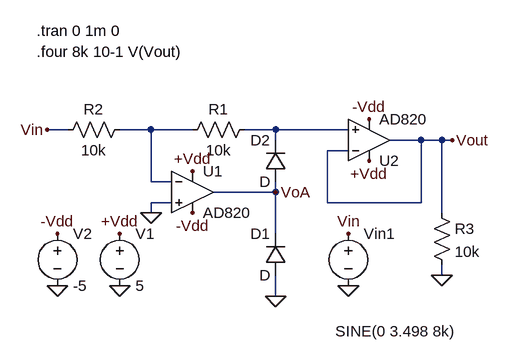
[diagram p0: schematic Etaj4 (2).asc]
Etaj4 (2).asc, the LTspice schematic file:
Version 4.1
SHEET 1 880 680
WIRE -64 -16 -96 -16
WIRE 64 -16 16 -16
WIRE 128 -16 64 -16
WIRE 256 -16 208 -16
WIRE 368 -16 256 -16
WIRE 256 0 256 -16
WIRE 480 0 432 0
WIRE 512 0 480 0
WIRE 528 0 512 0
WIRE 368 16 336 16
WIRE 64 64 64 -16
WIRE 96 64 64 64
WIRE 256 80 256 64
WIRE 256 80 160 80
WIRE 96 96 64 96
WIRE 336 96 336 16
WIRE 480 96 480 0
WIRE 480 96 336 96
WIRE 64 112 64 96
WIRE 512 112 512 0
WIRE 256 144 256 80
WIRE 512 208 512 192
WIRE 256 240 256 208
FLAG 512 208 0
FLAG 528 0 Vout
FLAG 256 240 0
FLAG 16 224 0
FLAG -80 224 0
FLAG 16 144 +Vdd
FLAG 128 48 +Vdd
FLAG 400 32 +Vdd
FLAG -80 144 -Vdd
FLAG 128 112 -Vdd
FLAG 400 -32 -Vdd
FLAG -96 -16 Vin
FLAG 64 112 0
FLAG 368 224 0
FLAG 368 144 Vin
FLAG 256 80 VoA
SYMBOL OpAmps\\AD820 128 16 R0
SYMATTR InstName U1
SYMBOL OpAmps\\AD820 400 64 M180
SYMATTR InstName U2
SYMBOL res 224 -32 R90
WINDOW 0 0 56 VBottom 2
WINDOW 3 32 56 VTop 2
SYMATTR InstName R1
SYMATTR Value 10k
SYMBOL res 32 -32 R90
WINDOW 0 0 56 VBottom 2
WINDOW 3 32 56 VTop 2
SYMATTR InstName R2
SYMATTR Value 10k
SYMBOL res 496 96 R0
SYMATTR InstName R3
SYMATTR Value 10k
SYMBOL diode 272 208 R180
WINDOW 0 24 64 Left 2
WINDOW 3 24 0 Left 2
SYMATTR InstName D1
SYMBOL diode 272 64 R180
WINDOW 0 24 64 Left 2
WINDOW 3 24 0 Left 2
SYMATTR InstName D2
SYMBOL voltage 16 128 R0
SYMATTR InstName V1
SYMATTR Value 5
SYMBOL voltage -80 128 R0
SYMATTR InstName V2
SYMATTR Value -5
SYMBOL voltage 368 128 R0
WINDOW 123 24 124 Left 2
WINDOW 39 0 0 Left 0
WINDOW 3 -20 166 Left 2
SYMATTR InstName Vin1
SYMATTR Value SINE(0 3.498 8k)
TEXT -112 -168 Left 2 !.tran 0 1m 0
TEXT -112 -136 Left 2 !.four 8k 10-1 V(Vout)

The netlist it stands for:
* Etaj4 (2).asc
X§U1 0 N001 +Vdd -Vdd VoA AD820  ; pins In+ In- V+ V- OUT
X§U2 N002 Vout +Vdd -Vdd Vout AD820  ; pins In+ In- V+ V- OUT
R1 N002 N001 10k
R2 N001 Vin 10k
R3 Vout 0 10k
D1 0 VoA D
D2 VoA N002 D
V1 +Vdd 0 5
V2 -Vdd 0 -5
Vin1 Vin 0 SINE(0 3.498 8k)
.model D D
.lib standard.dio
.tran 0 1m 0
.four 8k 10-1 V(Vout)
.backanno
.end